# Altium schematic sheet Schemat_blokowy.SchDoc
size 292 x 193 mm; Opracowal: Martyna Stankiewicz; projRevision: KD; Author: Martyna Stankiewicz; CompanyName: Politechnika Warszawska; Organization: EITI; Address1: Nowowiejska 15/19; Address2: 00-665 Warszawa; Revision: KD; SheetNumber: 1; SheetTotal: 8; HTTPLink: www.pw.edu.pl
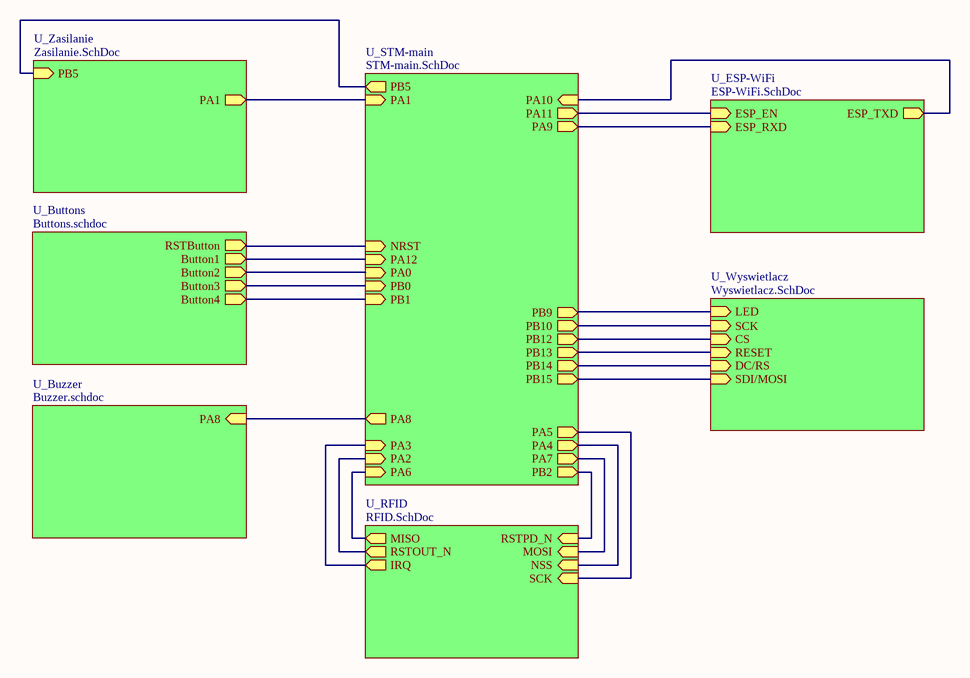
[diagram p0: Schemat_blokowy.SchDoc]

## Sub-sheets
U_Buttons = Buttons.schdoc: RSTButton (out), Button1 (out), Button2 (out), Button3 (out), Button4 (out)
U_Buzzer = Buzzer.schdoc: PA8 (in)
U_ESP-WiFi = ESP-WiFi.SchDoc: ESP_EN (in), ESP_TXD (out), ESP_RXD (in)
U_RFID = RFID.SchDoc: RSTPD_N (in), SCK (in), MISO (out), MOSI (in), NSS (in), RSTOUT_N (out), IRQ (out)
U_STM-main = STM-main.SchDoc: PA8 (out), PA9 (out), PA10 (in), PA11 (out), PA12 (in), PB9 (out), PB10 (out), PB12 (out), PB13 (out), PB14 (out), PB15 (out), NRST (in), PA0 (in), PA1 (in), PA2 (in), PA3 (in), PA5 (out), PA4 (out), PA6 (in), PA7 (out), PB0 (in), PB1 (in), PB2 (out), PB5 (out)
U_Wyswietlacz = Wyswietlacz.SchDoc: CS (in), RESET (in), DC/RS (in), SDI/MOSI (in), SCK (in), LED (in)
U_Zasilanie = Zasilanie.SchDoc: PA1 (out), PB5 (in)

## Nets
(unnamed): sheet U_Buttons/RSTButton, sheet U_STM-main/NRST
(unnamed): sheet U_Buttons/Button1, sheet U_STM-main/PA12
(unnamed): sheet U_Buttons/Button2, sheet U_STM-main/PA0
(unnamed): sheet U_Buttons/Button3, sheet U_STM-main/PB0
(unnamed): sheet U_Buttons/Button4, sheet U_STM-main/PB1
(unnamed): sheet U_Buzzer/PA8, sheet U_STM-main/PA8
(unnamed): sheet U_ESP-WiFi/ESP_EN, sheet U_STM-main/PA11
(unnamed): sheet U_ESP-WiFi/ESP_TXD, sheet U_STM-main/PA10
(unnamed): sheet U_ESP-WiFi/ESP_RXD, sheet U_STM-main/PA9
(unnamed): sheet U_RFID/RSTPD_N, sheet U_STM-main/PB2
(unnamed): sheet U_RFID/SCK, sheet U_STM-main/PA5
(unnamed): sheet U_RFID/MISO, sheet U_STM-main/PA6
(unnamed): sheet U_RFID/MOSI, sheet U_STM-main/PA7
(unnamed): sheet U_RFID/NSS, sheet U_STM-main/PA4
(unnamed): sheet U_RFID/RSTOUT_N, sheet U_STM-main/PA2
(unnamed): sheet U_RFID/IRQ, sheet U_STM-main/PA3
(unnamed): sheet U_Wyswietlacz/CS, sheet U_STM-main/PB12
(unnamed): sheet U_Wyswietlacz/RESET, sheet U_STM-main/PB13
(unnamed): sheet U_Wyswietlacz/DC/RS, sheet U_STM-main/PB14
(unnamed): sheet U_Wyswietlacz/SDI/MOSI, sheet U_STM-main/PB15
(unnamed): sheet U_Wyswietlacz/SCK, sheet U_STM-main/PB10
(unnamed): sheet U_Wyswietlacz/LED, sheet U_STM-main/PB9
(unnamed): sheet U_STM-main/PA1, sheet U_Zasilanie/PA1
(unnamed): sheet U_STM-main/PB5, sheet U_Zasilanie/PB5

## Notes on the sheet
- Data:
- Tytuł:
- Rev.:
- Rozm.:
- A4
- Strona:
- z
- PBL4
- Opracował: